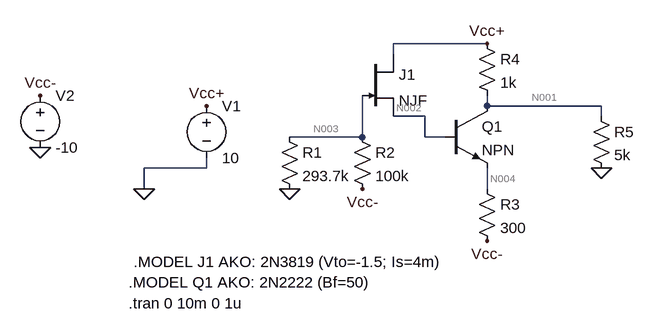
[diagram p0: schematic Draft1.asc]
Draft1.asc, the LTspice schematic file:
Version 4
SHEET 1 880 680
WIRE 336 0 192 0
WIRE 192 16 192 0
WIRE 336 96 336 80
WIRE 512 96 336 96
WIRE 240 112 192 112
WIRE 512 112 512 96
WIRE 144 144 144 80
WIRE 144 144 32 144
WIRE 240 144 240 112
WIRE 272 144 240 144
WIRE -96 192 -96 176
WIRE -96 192 -192 192
WIRE -192 224 -192 192
WIRE 336 224 336 192
FLAG 32 224 0
FLAG 512 192 0
FLAG 144 224 Vcc-
FLAG 336 304 Vcc-
FLAG -352 80 Vcc-
FLAG -96 96 Vcc+
FLAG 336 0 Vcc+
FLAG -192 224 0
FLAG -352 160 0
SYMBOL res 16 128 R0
SYMATTR InstName R1
SYMATTR Value 293.7k
SYMBOL res 128 128 R0
SYMATTR InstName R2
SYMATTR Value 100k
SYMBOL res 320 208 R0
SYMATTR InstName R3
SYMATTR Value 300
SYMBOL res 320 -16 R0
SYMATTR InstName R4
SYMATTR Value 1k
SYMBOL res 496 96 R0
SYMATTR InstName R5
SYMATTR Value 5k
SYMBOL npn 272 96 R0
SYMATTR InstName Q1
SYMBOL voltage -96 80 R0
WINDOW 123 0 0 Left 0
WINDOW 39 0 0 Left 0
SYMATTR InstName V1
SYMATTR Value 10
SYMBOL voltage -352 64 R0
WINDOW 123 0 0 Left 0
WINDOW 39 0 0 Left 0
SYMATTR InstName V2
SYMATTR Value -10
SYMBOL njf 144 16 R0
SYMATTR InstName J1
TEXT -216 400 Left 2 !.tran 0 10m 0 1u
TEXT -216 368 Left 2 !.MODEL Q1 AKO: 2N2222 (Bf=50)
TEXT -208 336 Left 2 !.MODEL J1 AKO: 2N3819 (Vto=-1.5; Is=4m)

The netlist it stands for:
* Draft1.asc
R1 N003 0 293.7k
R2 N003 Vcc- 100k
R3 N004 Vcc- 300
R4 Vcc+ N001 1k
R5 N001 0 5k
Q1 N001 N002 N004 0 NPN
V1 Vcc+ 0 10
V2 Vcc- 0 -10
J1 Vcc+ N003 N002 NJF
.model NPN NPN
.model PNP PNP
.lib standard.bjt
.model NJF NJF
.model PJF PJF
.lib standard.jft
.tran 0 10m 0 1u
.MODEL Q1 AKO: 2N2222 (Bf=50)
.MODEL J1 AKO: 2N3819 (Vto=-1.5; Is=4m)
.backanno
.end

* Results of the author's LTspice run, read from the files saved beside the schematic
* Operating Point, zero values left out:
*   V(n003) = -7.46 V
*   V(vcc-) = -10 V
*   V(n004) = -7.245 V
*   V(vcc+) = 10 V
*   V(n001) = 756 mV
*   V(n002) = -6.414 V
*   Ic(Q1) = 9.093 mA
*   Ib(Q1) = 90.93 µA
*   Ie(Q1) = -9.184 mA
*   Id(J1) = 90.93 µA
*   Ig(J1) = -18.53 pA
*   Is(J1) = -90.93 µA
*   I(R5) = 151.2 µA
*   I(R4) = 9.244 mA
*   I(R3) = 9.184 mA
*   I(R2) = 25.4 µA
*   I(R1) = -25.4 µA
*   I(V2) = 9.209 mA
*   I(V1) = -9.335 mA